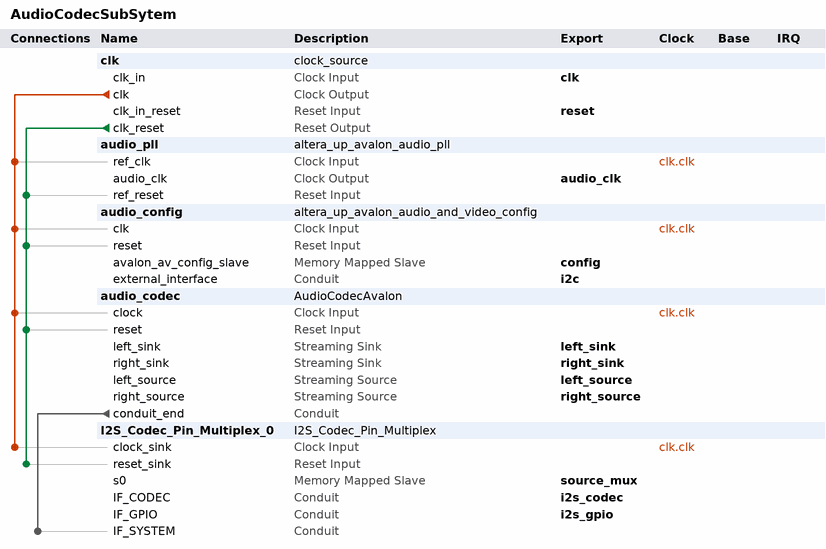
[diagram p0: system contents]
# Platform Designer (Qsys) system AudioCodecSubSytem, Cyclone V 5CSEMA5F31C6
# Parameters at their usual value, and those the tool derives, are not listed.
package require -exact qsys 16.1
create_system AudioCodecSubSytem
set_project_property DEVICE_FAMILY {Cyclone V}
set_project_property DEVICE 5CSEMA5F31C6

add_instance clk clock_source 16.1
set_instance_parameter_value clk clockFrequency 50000000

add_instance audio_pll altera_up_avalon_audio_pll 16.1
set_instance_parameter_value audio_pll gui_refclk 50.0

add_instance audio_config altera_up_avalon_audio_and_video_config 16.1
set_instance_parameter_value audio_config audio_in {Line In to ADC}
set_instance_parameter_value audio_config bit_length 24
set_instance_parameter_value audio_config board DE1-SoC
set_instance_parameter_value audio_config line_in_bypass false
set_instance_parameter_value audio_config sampling_rate {48 kHz}

add_instance audio_codec AudioCodecAvalon 1.0
set_instance_parameter_value audio_codec gDataWidth 24

add_instance I2S_Codec_Pin_Multiplex_0 I2S_Codec_Pin_Multiplex 1.0
set_instance_parameter_value I2S_Codec_Pin_Multiplex_0 gDataWidth 24
set_instance_parameter_value I2S_Codec_Pin_Multiplex_0 gDataWidthLen 5

# connections
add_connection clk.clk audio_codec.clock clock
add_connection clk.clk audio_config.clk clock
add_connection clk.clk audio_pll.ref_clk clock
add_connection clk.clk I2S_Codec_Pin_Multiplex_0.clock_sink clock
add_connection clk.clk_reset audio_codec.reset reset
add_connection clk.clk_reset audio_config.reset reset
add_connection clk.clk_reset audio_pll.ref_reset reset
add_connection clk.clk_reset I2S_Codec_Pin_Multiplex_0.reset_sink reset
add_connection audio_codec.conduit_end I2S_Codec_Pin_Multiplex_0.IF_SYSTEM conduit

# exported interfaces
add_interface audio_clk clock source
set_interface_property audio_clk EXPORT_OF audio_pll.audio_clk
add_interface clk clock sink
set_interface_property clk EXPORT_OF clk.clk_in
add_interface config avalon slave
set_interface_property config EXPORT_OF audio_config.avalon_av_config_slave
add_interface i2c conduit end
set_interface_property i2c EXPORT_OF audio_config.external_interface
add_interface i2s_codec conduit end
set_interface_property i2s_codec EXPORT_OF I2S_Codec_Pin_Multiplex_0.IF_CODEC
add_interface i2s_gpio conduit end
set_interface_property i2s_gpio EXPORT_OF I2S_Codec_Pin_Multiplex_0.IF_GPIO
add_interface left_sink avalon_streaming sink
set_interface_property left_sink EXPORT_OF audio_codec.left_sink
add_interface left_source avalon_streaming source
set_interface_property left_source EXPORT_OF audio_codec.left_source
add_interface reset reset sink
set_interface_property reset EXPORT_OF clk.clk_in_reset
add_interface right_sink avalon_streaming sink
set_interface_property right_sink EXPORT_OF audio_codec.right_sink
add_interface right_source avalon_streaming source
set_interface_property right_source EXPORT_OF audio_codec.right_source
add_interface source_mux avalon slave
set_interface_property source_mux EXPORT_OF I2S_Codec_Pin_Multiplex_0.s0

set_interconnect_requirement {$system} qsys_mm.clockCrossingAdapter HANDSHAKE
set_interconnect_requirement {$system} qsys_mm.enableEccProtection FALSE
set_interconnect_requirement {$system} qsys_mm.insertDefaultSlave FALSE
set_interconnect_requirement {$system} qsys_mm.maxAdditionalLatency 1

save_system AudioCodecSubSytem.qsys
